# Altium schematic sheet Э3.SchDoc: Блок охлаждения
size 420 x 297 mm; CheckedBy: Бойков; Author: Воропаева; CompanyName: РРБО-02-24; Address1: Address1; Address2: Address2; Address3: Address3; Address4: Address4; DocumentNumber: МРАГ.43 1122.600 Э3; SheetNumber: 1; SheetTotal: 1; DocumentType: Схема электрическая принципиальная; FirstReferrence: МРАГ.43 1122.500
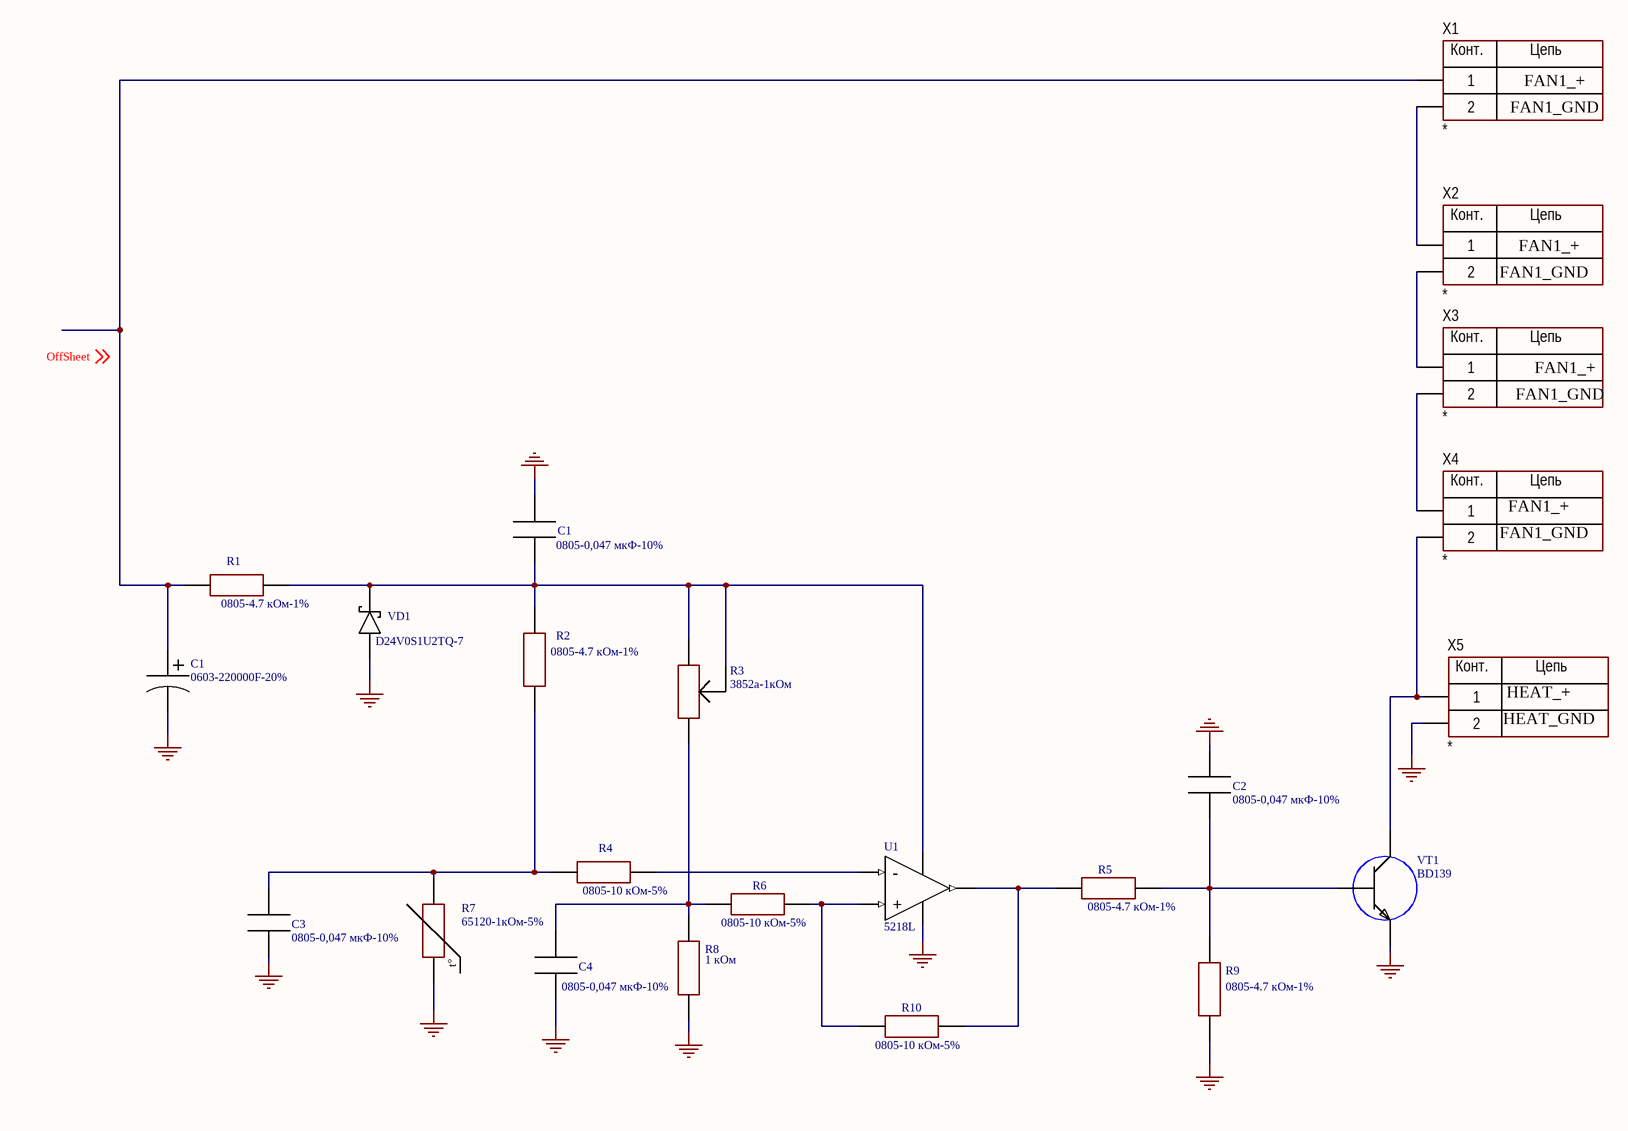
[diagram p0: Э3.SchDoc]

## Parts
C1  0805-0,047 мкФ-10%  [PCBComponent_1]
C2  0805-0,047 мкФ-10%  [PCBComponent_1]
C3  0805-0,047 мкФ-10%  [PCBComponent_1]
C4  0805-0,047 мкФ-10%  [PCBComponent_1]
R1  0805-4.7 кОм-1%  [Resistor SMD 0805]
R2  0805-4.7 кОм-1%  [Resistor SMD 0805]
R3  3852a-1кОм  [adj]
R4  0805-10 кОм-5%  [Resistor SMD 0805]
R5  0805-4.7 кОм-1%  [Resistor SMD 0805]
R6  0805-10 кОм-5%  [Resistor SMD 0805]
R7  65120-1кОм-5%  [Resistor SMD 0805]
R8  1 кОм  [Resistor SMD 0805]
R9  0805-4.7 кОм-1%  [Resistor SMD 0805]
R10  0805-10 кОм-5%  [Resistor SMD 0805]
U1  5218L  [PCBComponent_1 - duplicate4]
VD1  partnamber: D24V0S1U2TQ-7  [PCBComponent_1 - duplicate1]  (hidden comment: diod_stabilitron)
VT1  BD139  [transistor]
X1  *  [CON: 300-02P-5.0]
X2  *  [CON: 300-02P-5.0]
X3  *  [CON: 300-02P-5.0]
X4  *  [CON: 300-02P-5.0]
X5  *  [CON: 300-02P-5.0]
С1  0603-220000F-20%  [PCBComponent_1 - duplicate2]

## Nets
NetC1_1: C1.1 C2.1 C3.2 C4.2 R7.2 R8.1 R9.1 U1.4(GND) VD1.2 VT1.3 X5.2 С1.2
NetC1_2: C1.2 R1.2 R2.2 R3.1 R3.2 U1.8(VCC) VD1.1
NetC2_2: C2.2 R5.2 R9.2 VT1.2
NetC3_1: C3.1 R2.1 R4.1 R7.1
NetC4_1: C4.1 R3.3 R6.1 R8.2
NetR1_1: R1.1 X1.1 С1.1
NetR4_2: R4.2 U1.2(-)
NetR5_1: R5.1 R10.2 U1.1
NetR6_2: R6.2 R10.1 U1.3(+)
NetVT1_1: VT1.1 X4.2 X5.1
NetX1_2: X1.2 X2.1
NetX2_2: X2.2 X3.1
NetX3_2: X3.2 X4.1

## Notes on the sheet
- FAN1_+
- FAN1_GND
- HEAT_+
- HEAT_GND
- Labels drawn without touching a wire or pin: OffSheet
- Перв. примен.
- Справ. №
- Подп. и дата
- Инв. № дубл.
- Взам. инв. №
- Разраб.
- Изм.
- Лист
- № докум.
- Подп.
- Дата
- Лит.
- Масса
- Масштаб
- Пров.
- Т.контр.
- Листов
- Инв. № подл.
- Утв.
- Н.контр.
- 2.106-A3
- Копировал
- Формат А3
- (in symbol 2-Connector) Конт.; Цепь
- (in symbol resistor temerature) t°

## Library data of the parts
C1-C4 = condensator: Condensator_SDM_0805
R1 R2 R4-R6 R8-R10 = resistor_SMD0805: chrev: *; partnamber: *; Номинал: *
R3 = resistor peremen
R7 = resistor temerature: temperature: *; href: *
U1 = operasion_ysil
VD1 = diod_stabilitron: diod; manufacture: Diodes Incorporated; href: https://www.chipdip.ru/product0/8004701593
VT1 = transistor: href: *; manufacture: *; partnamber: *
X1-X5 = 2-Connector: Model: *; Manufacturer: *; HelpURL: *; ComponentKind: *
С1 = condensator+: 220000UF 20% 100V; partnamber: LNR2A224MSE; manufacture: Nichicon Corp.; href: https://www.chipdip.ru/product0/8005615214?from=suggest_product